# Altium schematic sheet PCI short card universal - 32 BIT-4.schdoc
size A3
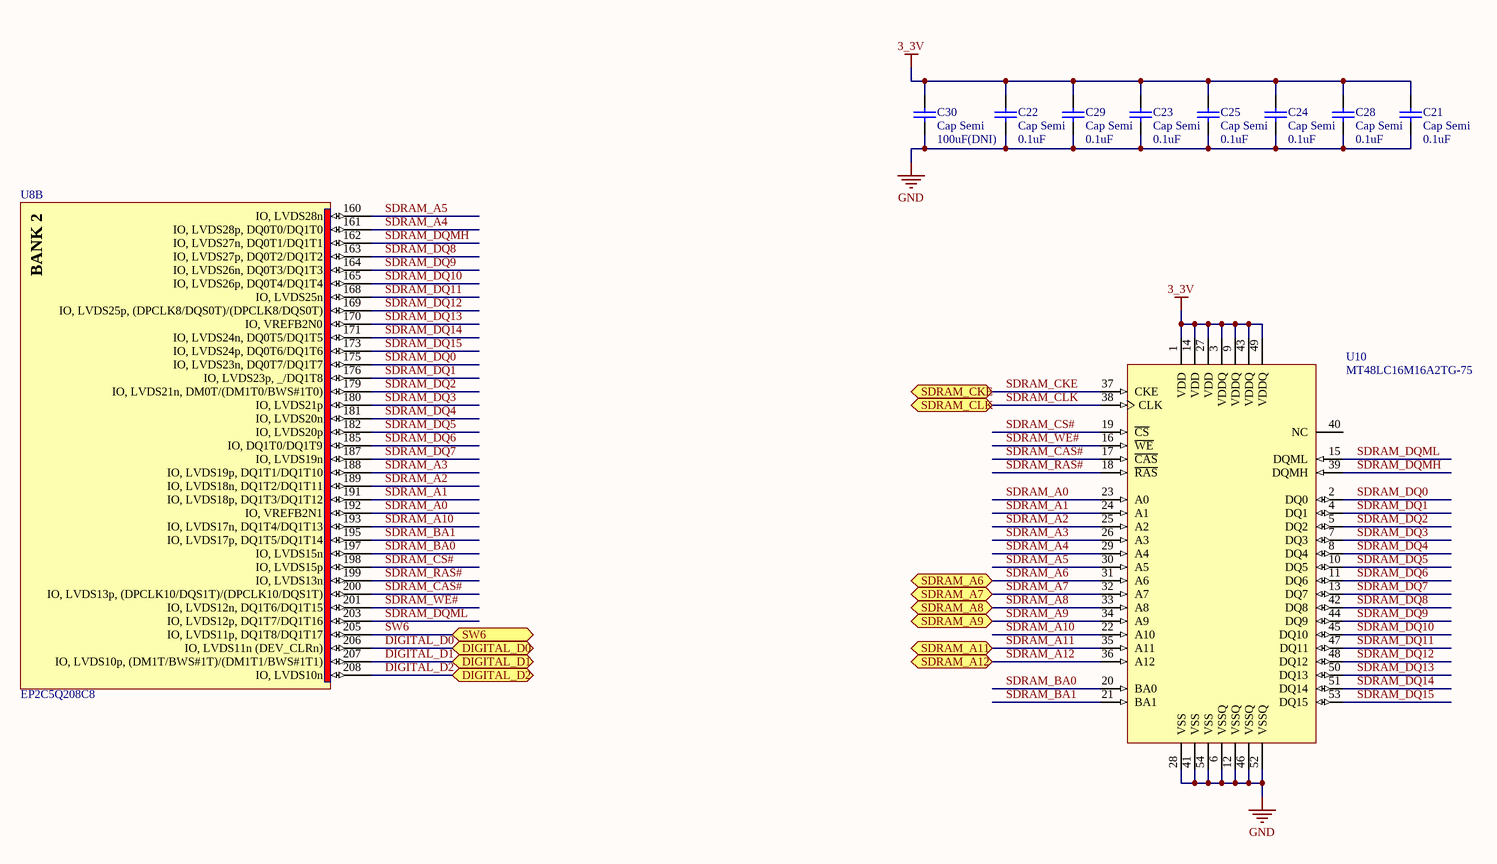
[diagram p0: PCI short card universal - 32 BIT-4.schdoc]

## Parts
C21  Cap Semi  value 0.1uF  [RESC1608N]
C22  Cap Semi  value 0.1uF  [RESC1608N]
C23  Cap Semi  value 0.1uF  [RESC1608N]
C24  Cap Semi  value 0.1uF  [RESC1608N]
C25  Cap Semi  value 0.1uF  [RESC1608N]
C28  Cap Semi  value 0.1uF  [RESC1608N]
C29  Cap Semi  value 0.1uF  [RESC1608N]
C30  Cap Semi  value 100uF(DNI)  [CD3225-1210]
U8  EP2C5Q208C8  [PQFP208_N]  (part B of 9)
U10  MT48LC16M16A2TG-75  [TSOP2-54_M]

## Ports
DIGITAL_D0, DIGITAL_D1, DIGITAL_D2, SDRAM_A6, SDRAM_A7, SDRAM_A8, SDRAM_A9, SDRAM_A11, SDRAM_A12, SDRAM_CKE, SDRAM_CLK, SW6

## Nets
3_3V: C21.2 C22.2 C23.2 C24.2 C25.2 C28.2 C29.2 C30.2 U10.1(VDD) U10.3(VDDQ) U10.9(VDDQ) U10.14(VDD) U10.27(VDD) U10.43(VDDQ) U10.49(VDDQ)
GND: C21.1 C22.1 C23.1 C24.1 C25.1 C28.1 C29.1 C30.1 U10.6(VSSQ) U10.12(VSSQ) U10.28(VSS) U10.41(VSS) U10.46(VSSQ) U10.52(VSSQ) U10.54(VSS)
DIGITAL_D0: U8.206(IO,_LVDS11n_(DEV_CLRn)) ; port DIGITAL_D0
DIGITAL_D1: U8.207(IO,_LVDS10p,_(DM1T/BWS#1T)/(DM1T1/BWS#1T1)) ; port DIGITAL_D1
DIGITAL_D2: U8.208(IO,_LVDS10n) ; port DIGITAL_D2
SDRAM_A0: U8.192(IO,_VREFB2N1) U10.23(A0)
SDRAM_A1: U8.191(IO,_LVDS18p,_DQ1T3/DQ1T12) U10.24(A1)
SDRAM_A2: U8.189(IO,_LVDS18n,_DQ1T2/DQ1T11) U10.25(A2)
SDRAM_A3: U8.188(IO,_LVDS19p,_DQ1T1/DQ1T10) U10.26(A3)
SDRAM_A4: U8.161(IO,_LVDS28p,_DQ0T0/DQ1T0) U10.29(A4)
SDRAM_A5: U8.160(IO,_LVDS28n) U10.30(A5)
SDRAM_A6: U10.31(A6) ; port SDRAM_A6
SDRAM_A7: U10.32(A7) ; port SDRAM_A7
SDRAM_A8: U10.33(A8) ; port SDRAM_A8
SDRAM_A9: U10.34(A9) ; port SDRAM_A9
SDRAM_A10: U8.193(IO,_LVDS17n,_DQ1T4/DQ1T13) U10.22(A10)
SDRAM_A11: U10.35(A11) ; port SDRAM_A11
SDRAM_A12: U10.36(A12) ; port SDRAM_A12
SDRAM_BA0: U8.197(IO,_LVDS15n) U10.20(BA0)
SDRAM_BA1: U8.195(IO,_LVDS17p,_DQ1T5/DQ1T14) U10.21(BA1)
SDRAM_CAS#: U8.200(IO,_LVDS13p,_(DPCLK10/DQS1T)/(DPCLK10/DQS1T)) U10.17(~{CAS})
SDRAM_CKE: U10.37(CKE) ; port SDRAM_CKE
SDRAM_CLK: U10.38(CLK) ; port SDRAM_CLK
SDRAM_CS#: U8.198(IO,_LVDS15p) U10.19(~{CS})
SDRAM_DQ0: U8.175(IO,_LVDS23n,_DQ0T7/DQ1T7) U10.2(DQ0)
SDRAM_DQ1: U8.176(IO,_LVDS23p,__/DQ1T8) U10.4(DQ1)
SDRAM_DQ2: U8.179(IO,_LVDS21n,_DM0T/(DM1T0/BWS#1T0)) U10.5(DQ2)
SDRAM_DQ3: U8.180(IO,_LVDS21p) U10.7(DQ3)
SDRAM_DQ4: U8.181(IO,_LVDS20n) U10.8(DQ4)
SDRAM_DQ5: U8.182(IO,_LVDS20p) U10.10(DQ5)
SDRAM_DQ6: U8.185(IO,_DQ1T0/DQ1T9) U10.11(DQ6)
SDRAM_DQ7: U8.187(IO,_LVDS19n) U10.13(DQ7)
SDRAM_DQ8: U8.163(IO,_LVDS27p,_DQ0T2/DQ1T2) U10.42(DQ8)
SDRAM_DQ9: U8.164(IO,_LVDS26n,_DQ0T3/DQ1T3) U10.44(DQ9)
SDRAM_DQ10: U8.165(IO,_LVDS26p,_DQ0T4/DQ1T4) U10.45(DQ10)
SDRAM_DQ11: U8.168(IO,_LVDS25n) U10.47(DQ11)
SDRAM_DQ12: U8.169(IO,_LVDS25p,_(DPCLK8/DQS0T)/(DPCLK8/DQS0T)) U10.48(DQ12)
SDRAM_DQ13: U8.170(IO,_VREFB2N0) U10.50(DQ13)
SDRAM_DQ14: U8.171(IO,_LVDS24n,_DQ0T5/DQ1T5) U10.51(DQ14)
SDRAM_DQ15: U8.173(IO,_LVDS24p,_DQ0T6/DQ1T6) U10.53(DQ15)
SDRAM_DQMH: U8.162(IO,_LVDS27n,_DQ0T1/DQ1T1) U10.39(DQMH)
SDRAM_DQML: U8.203(IO,_LVDS12p,_DQ1T7/DQ1T16) U10.15(DQML)
SDRAM_RAS#: U8.199(IO,_LVDS13n) U10.18(~{RAS})
SDRAM_WE#: U8.201(IO,_LVDS12n,_DQ1T6/DQ1T15) U10.16(~{WE})
SW6: U8.205(IO,_LVDS11p,_DQ1T8/DQ1T17) ; port SW6

Not connected (* = marked no-connect by the designer): U10 40(NC)

## Notes on the sheet
- (in symbol EP2C5Q208C8, part B) BANK 2

## Library data of the parts
C21-C25 C28-C30 = Cap Semi: Capacitor (Semiconductor SIM Model); Published: 8-Jun-2000; LatestRevisionDate: 17-Jul-2002; LatestRevisionNote: Re-released for DXP Platform.; PackageReference: C1206; Publisher: Altium Limited
U8 = EP2C5Q208C8: ALTERA Cyclone II Family, 1.2V FPGA, 142 I/O Pins, 2 PLLs, 208-Pin PQFP, Speed Grade 8, Commercial Grade; Note: DQS signal pins named according to DQ bus modes.  "/" separates each mode. ie. Modes x8/x9 / Modes x16/x18.; Published: 4-Mar-2005; LatestRevisionDate: 13-Apr-2006; LatestRevisionNote: IPC-7351 Footprint Added.; DatasheetVersion: ver2.3, Mar-2006; PackageVersion: ver14.2, Oct-2005; PackageReference: PQFP208; Publisher: Altium Limited; PackageDescription: 208-Pin Plastic Quad Flat Pack (PQFP208); Code_JEDEC: MS-029-FA-1; ComponentLink1Description: Manufacturer Link; ComponentLink1URL: http://www.altera.com/products/devices/cyclone2/cy2-index.jsp; ComponentLink2Description: Handbook; ComponentLink2URL: http://www.altera.com/literature/hb/cyc2/cyc2_cii5v1.pdf; ComponentLink3Description: Packaging Specification; ComponentLink3URL: http://www.altera.com/literature/ds/dspkg.pdf
U10 = MT48LC16M16A2TG-75: MICRON; CycleTime: 7.5ns @ CL = 3 (PC133); RowAddress: 8K (A0-A12); ColumnAddress: 512 (A0-A8); Published: 11-Oct-2004; LatestRevisionDate: 13-Apr-2006; LatestRevisionNote: IPC-7351 Footprint Added.; DatasheetVersion: rev.G, Sep-2003; PackageVersion: Sep-2003; PackageReference: TSOP2-54; Publisher: Altium Limited; PackageDescription: 54-Pin Plastic Small Outline Package 0.8 mm Pitch; Code_JEDEC: MS-024-FA; ComponentLink1Description: Manufacturer Link; ComponentLink1URL: http://www.micron.com; ComponentLink2Description: Datasheet; ComponentLink2URL: http://download.micron.com/pdf/datasheets/dram/sdram/256MSDRAM.pdf